# Altium schematic sheet FLASH.SchDoc
size A4; SheetNumber: 9; SheetTotal: 13
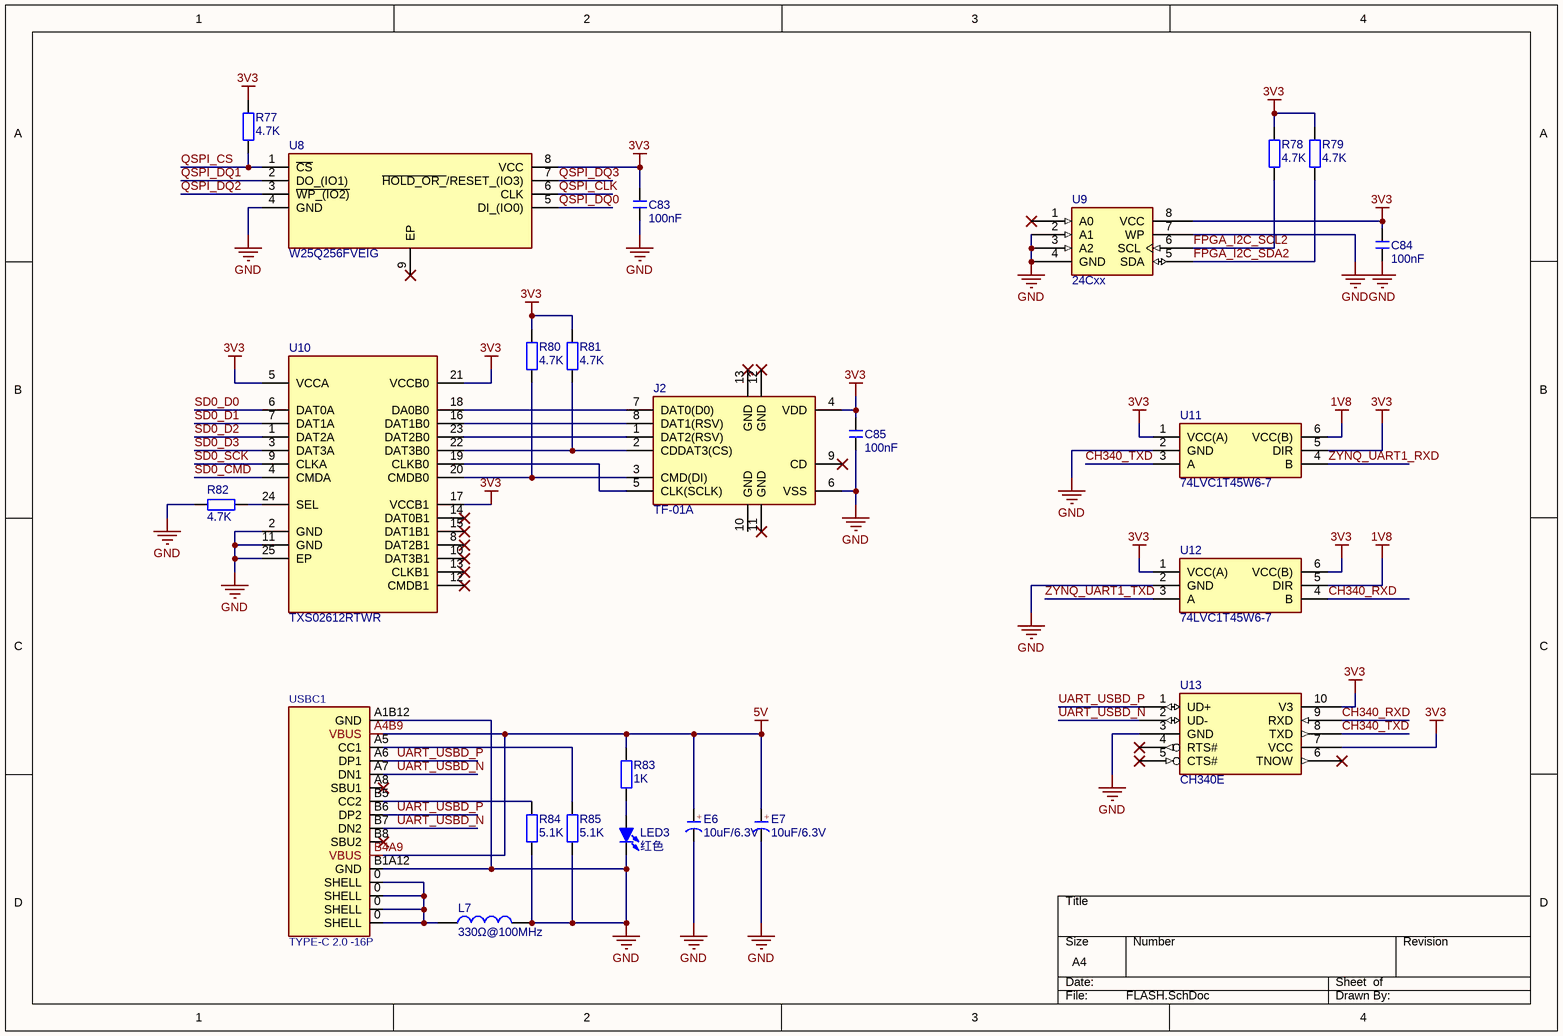
[diagram p0: FLASH.SchDoc]

## Parts
C83  100nF  [C 0402_L]
C84  100nF  [C 0402_L]
C85  100nF  [C 0402_L]
E6  10uF/6.3V  [CD A(3216)]
E7  10uF/6.3V  [CD A(3216)]
J2  TF-01A  [TF01A]
L7  330Ω@100MHz  [L 0805]
LED3  红色  [LED 0805G]
R77  4.7K  [R 0402_L]
R78  4.7K  [R 0402_L]
R79  4.7K  [R 0402_L]
R80  4.7K  [R 0402_L]
R81  4.7K  [R 0402_L]
R82  4.7K  [R 0402_L]
R83  1K  [R 0402_L]
R84  5.1K  [R 0402_L]
R85  5.1K  [R 0402_L]
U8  W25Q256FVEIG  [SON127P800X600X80-9N-D]
U9  24Cxx  [SOP8_L]
U10  TXS02612RTWR  [QFN24 4x4_L]
U11  74LVC1T45W6-7  [SOT23-6L]
U12  74LVC1T45W6-7  [SOT23-6L]
U13  CH340E  [MSOP10_L]
USBC1  TYPE-C 2.0 -16P  [USB-C-SMD_16P]

## Nets
1V8: U11.6(VCC(B)) U12.5(DIR)
3V3: C83.2 C84.2 C85.2 J2.4(VDD) R77.1 R78.1 R79.1 R80.1 R81.1 U8.8(VCC) U9.8(VCC) U10.5(VCCA) U10.17(VCCB1) U10.21(VCCB0) U11.1(VCC(A)) U11.5(DIR) U12.1(VCC(A)) U12.6(VCC(B)) U13.7(VCC) U13.10(V3)
5V: E6.1(A) E7.1(A) R83.2 USBC1.A4B9(VBUS) USBC1.B4A9(VBUS)
GND: C83.1 C84.1 C85.1 E6.2(K) E7.2(K) J2.6(VSS) L7.2 LED3.2(K) R82.1 R84.1 R85.1 U8.4(GND) U9.2(A1) U9.3(A2) U9.4(GND) U9.7(WP) U10.2(GND) U10.11(GND) U10.25(EP) U11.2(GND) U12.2(GND) U13.3(GND) USBC1.A1B12(GND) USBC1.B1A12(GND)
CH340_RXD: U12.4(B) U13.9(RXD)
CH340_TXD: U11.3(A) U13.8(TXD)
FPGA_I2C_SCL2: R78.2 U9.6(SCL)
FPGA_I2C_SDA2: R79.2 U9.5(SDA)
QSPI_CLK: U8.6(CLK)
QSPI_CS: R77.2 U8.1(~{CS})
QSPI_DQ0: U8.5(DI_(IO0))
QSPI_DQ1: U8.2(DO_(IO1))
QSPI_DQ2: U8.3(~{WP_(IO2)})
QSPI_DQ3: U8.7(~{HOLD_OR_}/RESET_(IO3))
SD0_CMD: U10.4(CMDA)
SD0_D0: U10.6(DAT0A)
SD0_D1: U10.7(DAT1A)
SD0_D2: U10.1(DAT2A)
SD0_D3: U10.3(DAT3A)
SD0_SCK: U10.9(CLKA)
UART_USBD_N: U13.2(UD-) USBC1.A7(DN1) USBC1.B7(DN2)
UART_USBD_P: U13.1(UD+) USBC1.A6(DP1) USBC1.B6(DP2)
ZYNQ_UART1_RXD: U11.4(B)
ZYNQ_UART1_TXD: U12.3(A)
NetJ2_1: J2.1(DAT2(RSV)) U10.23(DAT2B0)
NetJ2_2: J2.2(CDDAT3(CS)) R81.2 U10.22(DAT3B0)
NetJ2_3: J2.3(CMD(DI)) R80.2 U10.20(CMDB0)
NetJ2_5: J2.5(CLK(SCLK)) U10.19(CLKB0)
NetJ2_7: J2.7(DAT0(D0)) U10.18(DA0B0)
NetJ2_8: J2.8(DAT1(RSV)) U10.16(DAT1B0)
NetL7_1: L7.1 USBC1.0(SHELL)
NetLED3_1: LED3.1(A) R83.1
NetR82_2: R82.2 U10.24(SEL)
NetR84_2: R84.2 USBC1.B5(CC2)
NetR85_2: R85.2 USBC1.A5(CC1)

Not connected (* = marked no-connect by the designer): J2 9(CD)* 10(GND) 11(GND)* 12(GND)* 13(GND)*; U8 9(EP)*; U9 1(A0)*; U10 8(DAT2B1)* 10(DAT3B1)* 12(CMDB1)* 13(CLKB1)* 14(DAT0B1)* 15(DAT1B1)*; U13 4(RTS#)* 5(CTS#)* 6(TNOW)*; USBC1 A8(SBU1)* B8(SBU2)*

## Notes on the sheet
- (in symbol C-CD) +

## Library data of the parts
C83-C85 = C: 无极性贴片电容; 版权归属: 源创客; BOM名称: 无极性贴片电容; 学习资源: www.ooocke.com
E6 E7 = C-CD: 贴片钽电容; 版权归属: 源创客; BOM名称: 贴片钽电容; 学习资源: www.ooocke.com
J2 = TF-01A: TF卡座; Manufacturer_Name: Korean Hroparts Elec; Datasheet Link: https://datasheet.lcsc.com/szlcsc/1903221101_Korean-Hroparts-Elec-TF-01A_C91145.pdf; Height: 1.85mm; Manufacturer_Part_Number: TF-01A
L7 = L: 小功率贴片电感; 版权归属: 源创客; BOM名称: 小功率贴片电感; 学习资源: www.ooocke.com
LED3 = LED-SMD: 贴片LED; 版权归属: 源创客; BOM名称: 贴片LED; 学习资源: www.ooocke.com
R77-R85 = R: 贴片电阻; 版权归属: 源创客; BOM名称: 贴片电阻; 学习资源: www.ooocke.com
U8 = W25Q256FVEIG: 外置Flash; Manufacturer_Name: Winbond; Datasheet Link: https://www.winbond.com/resource-files/w25q256fv%20revi%2002262016%20kms.pdf; Height: 0.8mm; Manufacturer_Part_Number: W25Q256FVEIG; Mouser Part Number: N/A; Mouser Price/Stock: https://www.mouser.co.uk/ProductDetail/Winbond/W25Q256FVEIG?qs=rkhjVJ6%2F3ELJv0ZVUL2rAg%3D%3D; Arrow Part Number: W25Q256FVEIG; Arrow Price/Stock: https://www.arrow.com/en/products/w25q256fveig/winbond-electronics
U9 = 24Cxx: 外置EEPROM; 版权归属: 源创客; BOM名称: 外置EEPROM; 学习资源: www.ooocke.com
U10 = TXS02612RTWR: SD/TF卡芯片; Manufacturer_Name: Texas Instruments; Datasheet Link: http://www.ti.com/lit/gpn/txs02612; Height: 0.8mm; Manufacturer_Part_Number: TXS02612RTWR; Mouser Part Number: 595-TXS02612RTWR; Mouser Price/Stock: https://www.mouser.co.uk/ProductDetail/Texas-Instruments/TXS02612RTWR?qs=dqESbKqT1jaNFKC1R4M7hw%3D%3D; Arrow Part Number: TXS02612RTWR; Arrow Price/Stock: https://www.arrow.com/en/products/txs02612rtwr/texas-instruments?region=nac
U11 U12 = 74LVC1T45W6-7: 单向电平转换; Manufacturer_Name: Diodes Inc.; Datasheet Link: https://www.diodes.com/assets/Datasheets/74LVC1T45.pdf; Height: 1.4mm; Manufacturer_Part_Number: 74LVC1T45W6-7; Mouser Part Number: 621-74LVC1T45W6-7; Mouser Price/Stock: https://www.mouser.co.uk/ProductDetail/Diodes-Incorporated/74LVC1T45W6-7?qs=Oxncjon6mbp2oDYwZRj9AA%3D%3D; Arrow Part Number: 74LVC1T45W6-7; Arrow Price/Stock: https://www.arrow.com/en/products/74lvc1t45w6-7/diodes-incorporated?region=nac
U13 = CH340E: USB转串口; 联系卖家，免费技术支持: 唯一出售店铺网址https://shop463601444.taobao.com
USBC1 = USB2.0_Type-C_16Pin: USB2.0_Type-C_16Pin母座; 联系卖家 免费技术支持: 封装库来自淘宝卖家ID：黄晶宝石